# Altium schematic sheet Filter7.SchDoc
size 420 x 297 mm; SheetNumber: 13; SheetTotal: 13
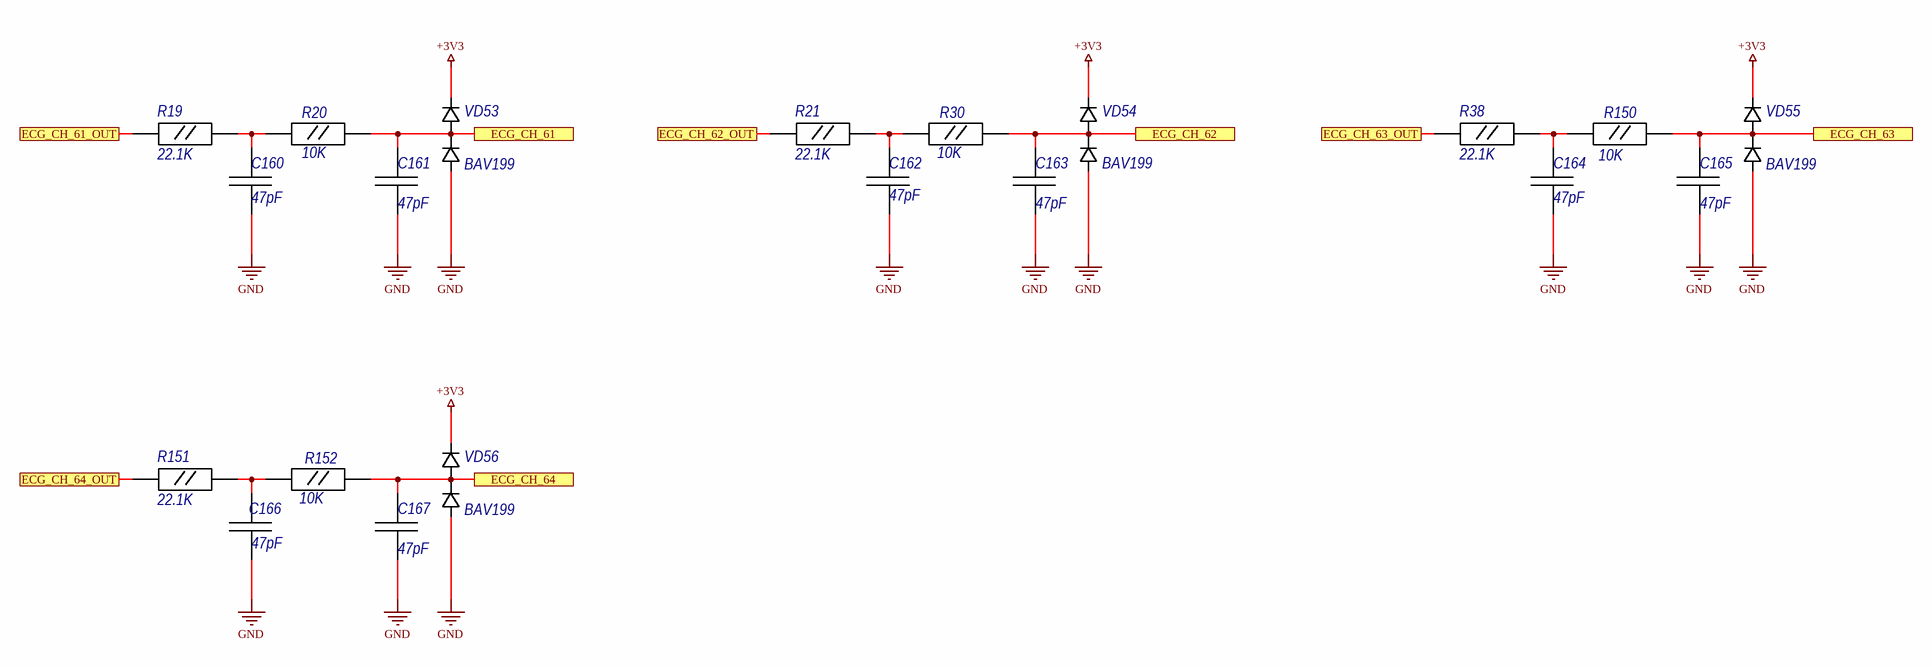
[diagram p0: Filter7.SchDoc]

## Parts
C160  47pF  [C0603]
C161  47pF  [C0603]
C162  47pF  [C0603]
C163  47pF  [C0603]
C164  47pF  [C0603]
C165  47pF  [C0603]
C166  47pF  [C0603]
C167  47pF  [C0603]
R19  22.1K  [R0603]
R20  10K  [R0603]
R21  22.1K  [R0603]
R30  10K  [R0603]
R38  22.1K  [R0603]
R150  10K  [R0603]
R151  22.1K  [R0603]
R152  10K  [R0603]
VD53  BAV199  [SOT23]
VD54  BAV199  [SOT23]
VD55  BAV199  [SOT23]
VD56  BAV199  [SOT23]

## Ports
ECG_CH_61, ECG_CH_61_OUT, ECG_CH_62, ECG_CH_62_OUT, ECG_CH_63, ECG_CH_63_OUT, ECG_CH_64, ECG_CH_64_OUT

## Nets
+3V3: VD53.2 VD54.2 VD55.2 VD56.2
GND: C160.1 C161.1 C162.1 C163.1 C164.1 C165.1 C166.1 C167.1 VD53.1 VD54.1 VD55.1 VD56.1
ECG_CH_61: C161.2 R20.2 VD53.3 ; port ECG_CH_61
ECG_CH_61_OUT: R19.1 ; port ECG_CH_61_OUT
ECG_CH_62: C163.2 R30.2 VD54.3 ; port ECG_CH_62
ECG_CH_62_OUT: R21.1 ; port ECG_CH_62_OUT
ECG_CH_63: C165.2 R150.2 VD55.3 ; port ECG_CH_63
ECG_CH_63_OUT: R38.1 ; port ECG_CH_63_OUT
ECG_CH_64: C167.2 R152.2 VD56.3 ; port ECG_CH_64
ECG_CH_64_OUT: R151.1 ; port ECG_CH_64_OUT
NetC160_2: C160.2 R19.2 R20.1
NetC162_2: C162.2 R21.2 R30.1
NetC164_2: C164.2 R38.2 R150.1
NetC166_2: C166.2 R151.2 R152.1

## Notes on the sheet
- Перв. примен.
- Справ. №
- Подп. и дата
- Инв. № дубл.
- Взам. инв. №
- Разраб.
- Изм.
- Лист
- № докум.
- Подп.
- Дата
- Лит.
- Масса
- Масштаб
- Пров.
- Т.контр.
- Листов
- Инв. № подл.
- Утв.
- Н.контр.
- 2.106-A3
- Копировал
- Формат А3

## Library data of the parts
C160-C167 = CC_SMD_0603: Ceramic Capacitor SMD; Package: 0603; Value: 47pF
R19-R21 R30 R38 R150-R152 = R0603: Resistor SMD
  R19 R21 R38 R151: Value: 22.1K
  R20 R30 R150 R152: Value: 10K
VD53-VD56 = DIODE_BAV199: Diod Schottky; Diode Type: Standard; Package: SOT-23; PartNumber: BAV199; Manufacturer Part Number 1: BAV199